# EAGLE design tunnelAmp (EAGLE 9.2.0)
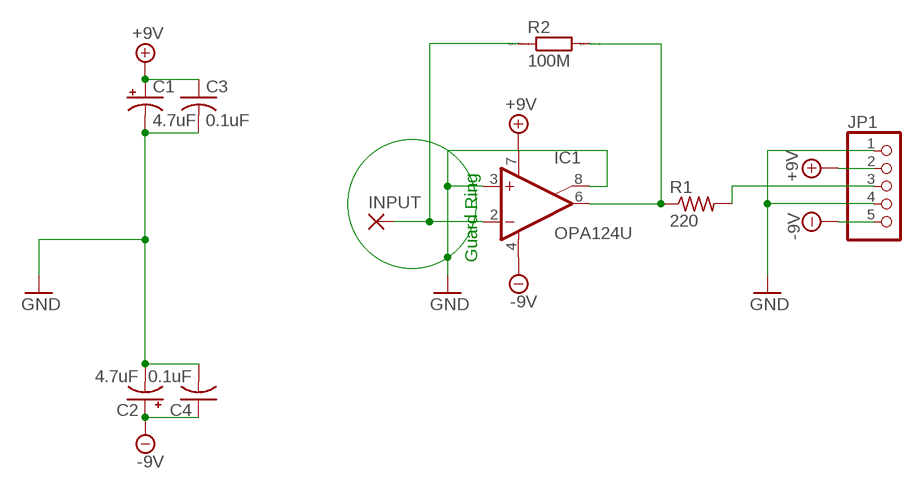
[diagram p0: schematic, sheet 1]

## Parts
C1  4.7uF  CPOL-USC/6032-28W  [C/6032-28W]
C2  4.7uF  CPOL-USC/6032-28W  [C/6032-28W]
C3  0.1uF  C-USC0603  [C0603]
C4  0.1uF  C-USC0603  [C0603]
IC1  OPA124U  [SO08]
INPUT  2,54/1,1  [2,54/1,1]
JP1  PINHD-1X5  [1X05]
R1  220  R-US_R0603  [R0603]
R2  100M  RR1206  [R1206]

## Nets
+9V: C1.+ C3.1 IC1.7(V+) JP1.2
-9V: C2.+ C4.1 IC1.4(V-) JP1.5
GND: C1.- C2.- C3.2 C4.2 IC1.3(+IN) IC1.8(SUBS) JP1.1 JP1.4
N$1: IC1.6(OUT) R1.1 R2.2
N$2: JP1.3 R1.2
N$4: IC1.2(-IN) INPUT.1(P) R2.1

## Notes on the sheet
- Guard Ring

## Library data of the parts
C1 C2 = resistor:CPOL-US: POLARIZED CAPACITOR, American symbol
C3 C4 = resistor:C-US: CAPACITOR, American symbol
IC1 = burr-brown:OPA124U: Difet Operational Amplifier
INPUT = wirepad:2,54/1,1: THROUGH-HOLE PAD
JP1 = pinhead:PINHD-1X5: PIN HEADER
R1 = resistor:R-US_: RESISTOR, American symbol
R2 = eagle-ltspice:R: RESISTOR, European symbol; SPICEMODEL: NONE; SPICEPREFIX: R

## Board
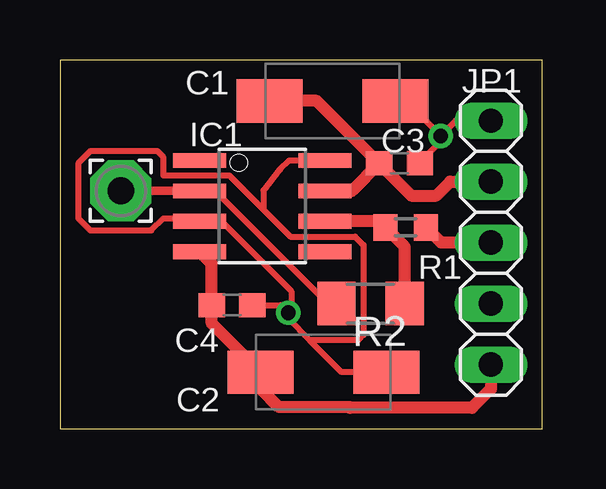
[diagram p1: board, top side]
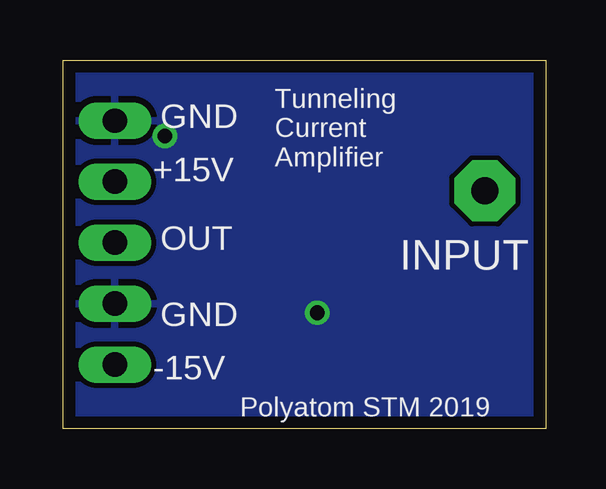
[diagram p2: board, bottom side, seen from below]

Size 20.12 x 15.36 mm. Coordinates in mm from the lower left corner, seen from the top.
Outline: 0,0 20.12,0 20.12,15.36 0,15.36 0,0
Copper layers (1*16): Top 0.035mm / dielectric 1.5mm / Bottom 0.035mm
Design rules "default *": minimum track width 10mil, minimum drill 24mil, track to track 8mil, track to pad 8mil, pad to pad 8mil, via to via 8mil, smd to smd 8mil, copper to edge 20mil, drill to drill 8mil, minimum pad ring 10mil, minimum via ring 8mil, stop-mask expansion 4mil, vias tented up to drill 0mil, thermal gap 10mil

### Footprints (pad centres in the part's own frame; a part is rotated, then mirrored left to right if it is on the bottom)
C/6032-28W = smd 2.75 x 1.8: + 2.625,0; - -2.625,0
C0603 = smd 1.1 x 1: 1 -0.85,0; 2 0.85,0
SO08 = smd 0.61 x 2.21: 1 -1.905,-2.616; 2 -0.635,-2.616; 3 0.635,-2.616; 4 1.905,-2.616; 5 1.905,2.616; 6 0.635,2.616; 7 -0.635,2.616; 8 -1.905,2.616
2,54/1,1 = drill 1.118 pad 2.54 octagon: 1 0,0
1X05 = drill 1.016 long: 1 -5.08,0; 2 -2.54,0; 3 0,0; 4 2.54,0; 5 5.08,0
R0603 = smd 1 x 1.1: 1 -0.85,0; 2 0.85,0
R1206 = smd 1.6 x 1.803: 1 -1.422,0; 2 1.422,0

### Placement (x,y rotation side)
C1  11.37,13.65 180 top
C2  10.99,2.35 180 top
C3  14.16,11.05 0 top
C4  7.18,5.14 0 top
IC1  8.45,9.27 270 top
INPUT  2.54,9.91 0 top
JP1  17.97,7.75 270 top
R1  14.41,8.38 0 top
R2  12.95,5.21 0 top

### Tracks (layer width: path | path; a pad name or v marks a point on that pad's centre or on a via)
+9V
  Top 0.508: IC1.7 12.17,9.91 C3.1 | JP1.2 16.27,10.29 15.7,9.71 14.65,9.71 C3.1 | C1.+ 10.71,13.65 C3.1
-9V
  Top 0.254: 12.1,0.86 12.07,0.89 | C2.+ 8.36,1.67
  Top 0.508: 12.07,0.89 9.14,0.89 8.36,1.67 | JP1.5 17.97,1.65 17.18,0.86 12.1,0.86 | C2.+ 6.33,4.38 C4.1 6.33,6.87 IC1.4
GND  (via drill 0.61)
  Top 0.254: 8.49,9.12 9.61,8 12.3,8 12.66,7.64 12.66,3.9 12.45,3.68 10.41,3.68 | 8.49,9.12 7.07,10.54 4.32,10.54 4.32,11.3 4.06,11.56 1.27,11.56 0.76,11.05 0.76,8.76 1.27,8.26 3.81,8.26 4.32,8.76 5.7,8.76 IC1.3 6.73,8.64 9.65,5.71 9.65,4.95 v9.53,4.83 | 8.49,9.12 8.49,9.91 9.18,10.79 9.57,11.18 IC1.8 | C2.- 11.75,2.35 10.41,3.68 | C1.- 14.41,13.65 v15.88,12.19 | JP1.1 16.51,12.83 v15.88,12.19 | C3.2 15.01,11.1 15.93,12.01 v15.88,12.19 | 10.41,3.68 9.53,4.57 v9.53,4.83 | C4.2 9.21,5.14 v9.53,4.83
  pour Bottom: -0.06,15.37 19.88,15.37 19.88,0.13 -0.06,0.13
N$1
  Top 0.254: R1.1 13.31,8.64
  Top 0.508: R2.2 14.38,7.57 R1.1 | 13.31,8.64 IC1.6
N$2
  Top 0.508: JP1.3 15.9,7.75 R1.2
N$4
  Top 0.254: IC1.2 6.48,9.91 11.18,5.21 R2.1
  Top 0.356: IC1.2 INPUT.1

### Text on the board
bNames: GND | Tunneling / Current / Amplifier | +15V | OUT | GND | -15V | Polyatom STM 2019